# EAGLE design progtypec4-emb-nomux4sercomQFP (EAGLE 9.0.1)

## Sheet 1 of 2
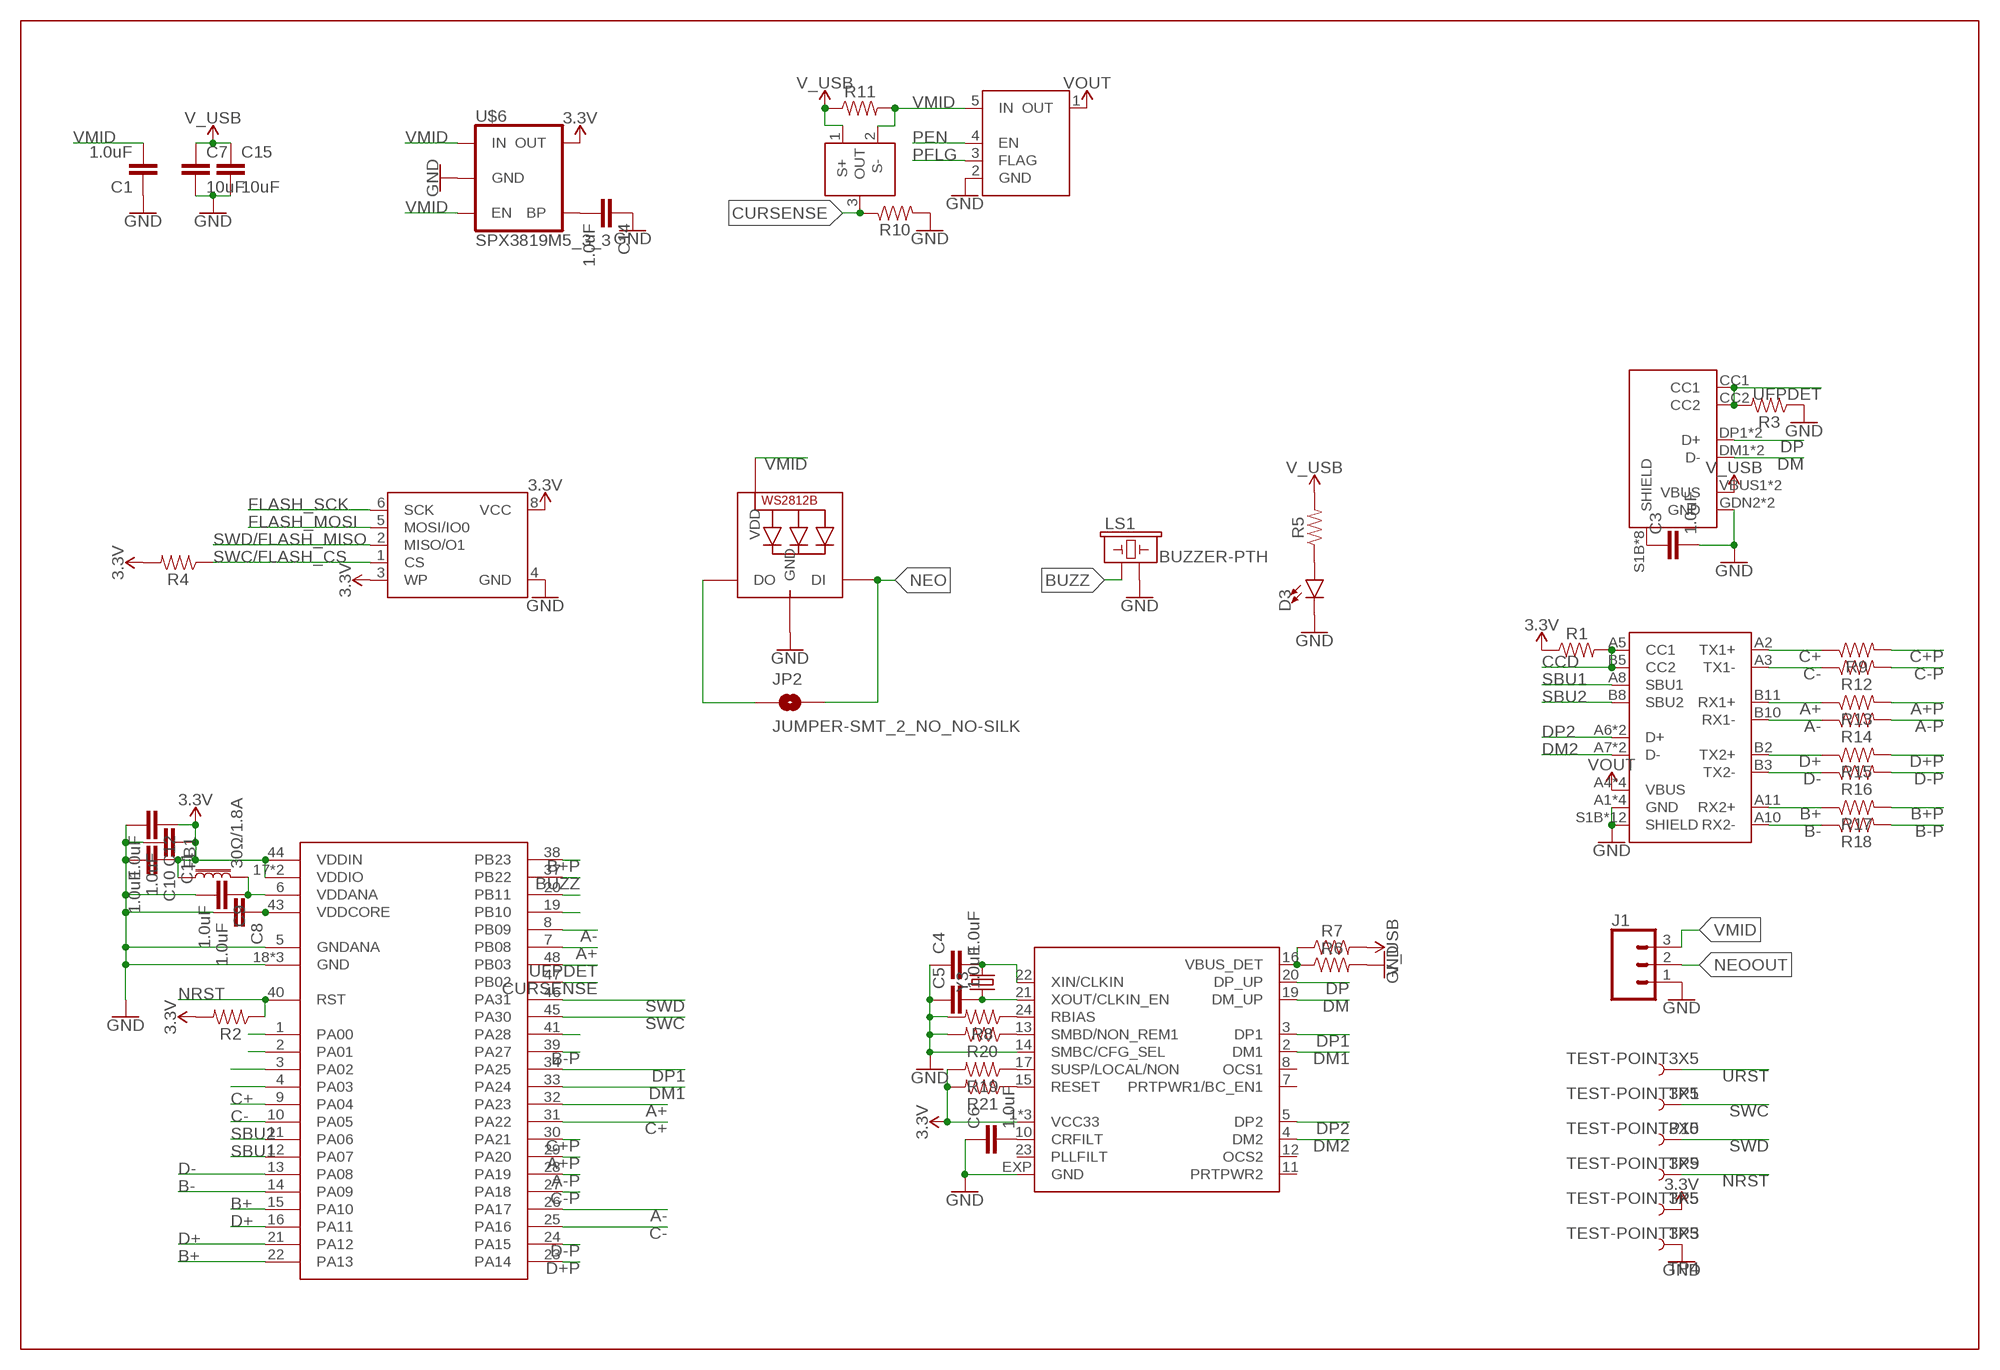
[diagram p0: schematic, sheet 1]

### Parts
C1  1.0uF  1.0UF-0603-16V-10%  [0603]
C3  1.0uF  1.0UF-0603-16V-10%  [0603]
C4  1.0uF  1.0UF-0603-16V-10%  [0603]
C5  1.0uF  1.0UF-0603-16V-10%  [0603]
C6  1.0uF  1.0UF-0603-16V-10%  [0603]
C7  10uF  10UF-0805-10V-10%  [0805]
C8  1.0uF  1.0UF-0603-16V-10%  [0603]
C9  1.0uF  1.0UF-0603-16V-10%  [0603]
C10  1.0uF  1.0UF-0603-16V-10%  [0603]
C11  1.0uF  1.0UF-0603-16V-10%  [0603]
C12  1.0uF  1.0UF-0603-16V-10%  [0603]
C14  1.0uF  1.0UF-0603-16V-10%  [0603]
C15  10uF  10UF-0805-10V-10%  [0805]
D3  LED0603  [LED-0603]
FB1  30Ω/1.8A  FERRITE_BEAD-0603  [0603]
J1  CONN_03SMD_RA_MALE  [1X03_SMD_RA_MALE]
JP2  JUMPER-SMT_2_NO_NO-SILK  [SMT-JUMPER_2_NO_NO-SILK]
LED1  WS2812B3535  [LED3535]
LS1  BUZZER-PTH  [BUZZER-12MM]
R1  RESISTOR0603  [0603]
R2  RESISTOR0603  [0603]
R3  RESISTOR0603  [0603]
R4  RESISTOR0603  [0603]
R5  RESISTOR0603  [0603]
R6  RESISTOR0603  [0603]
R7  RESISTOR0603  [0603]
R8  RESISTOR0603  [0603]
R9  RESISTOR0603  [0603]
R10  RESISTOR0603  [0603]
R11  RESISTOR1206  [1206]
R12  RESISTOR0603  [0603]
R13  RESISTOR0603  [0603]
R14  RESISTOR0603  [0603]
R15  RESISTOR0603  [0603]
R16  RESISTOR0603  [0603]
R17  RESISTOR0603  [0603]
R18  RESISTOR0603  [0603]
R19  RESISTOR0603  [0603]
R20  RESISTOR0603  [0603]
R21  RESISTOR0603  [0603]
TP1  TEST-POINT3X5  [PAD.03X.05]
TP3  TEST-POINT3X5  [PAD.03X.05]
TP4  TEST-POINT3X5  [PAD.03X.05]
TP5  TEST-POINT3X5  [PAD.03X.05]
TP9  TEST-POINT3X5  [PAD.03X.05]
TP10  TEST-POINT3X5  [PAD.03X.05]
U$1  USB-C-HORZ-F  [USB-C_24PIN_HORZ-F-UNTESTED]
U$2  USB-C_USB2ONLY-HORZ-F_12P  [USB-C_12PIN_HORZ-F]
U$3  ZXCT1107  [SOT23-3]
U$4  AP22804/14*W5  [SOT23-5]
U$5  USB2422  [QFN24_4X4_MOREPAD]
U$6  SPX3819M5_3_3  V_REG_SPX3819-SOT23-5  [SOT23-5]
U$7  GD25D10C/05CE  [UDFN8]
U$9  ATSAMD2G1A-A  [TQFP48_7X7]
Y3  CRYSTALSMD-3.2X2.5  [CRYSTAL-SMD-3.2X2.5MM]

### Nets
3.3V: C10.1 C11.1 C12.1 FB1.1 R1.1 R2.2 R4.2 R19.2 R21.2 TP3.P$1 U$5.1(VCC33) U$5.9(VCC33) U$5.18(VCC33) U$6.5(OUT) U$7.3(WP) U$7.8(VCC) U$9.17(VDDIO) U$9.36(VDDIO) U$9.44(VDDIN)
A+: R13.1 U$1.B11(RX1+) U$9.7(PB08) U$9.32(PA23)
A+P: R13.2 U$9.29(PA20)
A-: R14.1 U$1.B10(RX1-) U$9.8(PB09) U$9.26(PA17)
A-P: R14.2 U$9.28(PA19)
B+: R17.1 U$1.A11(RX2+) U$9.15(PA10) U$9.22(PA13)
B+P: R17.2 U$9.38(PB23)
B-: R18.1 U$1.A10(RX2-) U$9.14(PA09)
B-P: R18.2 U$9.39(PA27)
BUZZ: LS1.+ U$9.37(PB22)
C+: R9.1 U$1.A2(TX1+) U$9.9(PA04) U$9.31(PA22)
C+P: R9.2 U$9.30(PA21)
C-: R12.1 U$1.A3(TX1-) U$9.10(PA05) U$9.25(PA16)
C-P: R12.2 U$9.27(PA18)
CCD: R1.2 U$1.A5(CC1) U$1.B5(CC2)
CURSENSE: R10.1 U$3.3(OUT) U$9.47(PB02)
D+: R15.1 U$1.B2(TX2+) U$9.16(PA11) U$9.21(PA12)
D+P: R15.2 U$9.23(PA14)
D-: R16.1 U$1.B3(TX2-) U$9.13(PA08)
D-P: R16.2 U$9.24(PA15)
DM: U$2.DM1(D-) U$2.DM2(D-) U$5.19(DM_UP)
DM1: U$5.2(DM1) U$9.33(PA24)
DM2: U$1.A7(D-) U$1.B7(D-) U$5.4(DM2)
DP: U$2.DP1(D+) U$2.DP2(D+) U$5.20(DP_UP)
DP1: U$5.3(DP1) U$9.34(PA25)
DP2: U$1.A6(D+) U$1.B6(D+) U$5.5(DP2)
FLASH_MOSI: U$7.5(MOSI/IO0)
FLASH_SCK: U$7.6(SCK)
GND: C1.1 C3.2 C4.1 C5.1 C6.1 C7.2 C8.2 C9.2 C10.2 C11.2 C12.2 C14.1 C15.2 D3.C J1.1 LED1.4(GND) LS1.- R3.1 R6.2 R8.2 R10.2 R20.2 TP4.P$1 U$1.A1(GND) U$1.A12(GND) U$1.B1(GND) U$1.B12(GND) U$1.S1B(SHIELD) U$1.S1T(SHIELD) U$1.S2B(SHIELD) U$1.S2T(SHIELD) U$1.S3B(SHIELD) U$1.S3T(SHIELD) U$1.S4B(SHIELD) U$1.S4T(SHIELD) U$1.S5B(SHIELD) U$1.S5T(SHIELD) U$1.S6B(SHIELD) U$1.S6T(SHIELD) U$2.GDN2(GND) U$2.GND1(GND) U$4.2(GND) U$5.14(SMBC/CFG_SEL) U$5.EXP(GND) U$6.2(GND) U$7.4(GND) U$9.5(GNDANA) U$9.18(GND) U$9.35(GND) U$9.42(GND)
N$1: D3.A R5.1
N$3: R6.1 R7.1 U$5.16(VBUS_DET)
N$6: R8.1 U$5.24(RBIAS)
N$7: C4.2 U$5.22(XIN/CLKIN) Y3.3
N$8: C5.2 U$5.21(XOUT/CLKIN_EN) Y3.1
N$10: R19.1 U$5.17(SUSP/LOCAL/NON)
N$11: C6.2 U$5.10(CRFILT)
N$12: R20.1 U$5.13(SMBD/NON_REM1)
N$15: U$9.2(PA01)
N$16: C3.1 U$2.S1B(SHIELD) U$2.S1T(SHIELD) U$2.S2B(SHIELD) U$2.S2T(SHIELD) U$2.S3B(SHIELD) U$2.S3T(SHIELD) U$2.S4B(SHIELD) U$2.S4T(SHIELD)
N$17: U$9.3(PA02)
N$18: U$9.4(PA03)
N$23: U$9.1(PA00)
N$26: U$9.20(PB11)
N$27: C14.2 U$6.4(BP)
N$28: U$9.19(PB10)
N$29: U$9.41(PA28)
NEO: JP2.2 LED1.1(DI)
NEOOUT: J1.2 JP2.1 LED1.3(DO)
NRST: R2.1 TP5.P$1 U$9.40(RST)
PEN: U$4.4(EN)
PFLG: U$4.3(FLAG)
SBU1: U$1.A8(SBU1) U$9.12(PA07)
SBU2: U$1.B8(SBU2) U$9.11(PA06)
SWC: TP10.P$1 U$9.45(PA30)
SWC/FLASH_CS: R4.1 U$7.1(CS)
SWD: TP9.P$1 U$9.46(PA31)
SWD/FLASH_MISO: U$7.2(MISO/O1)
UFPDET: R3.2 U$2.CC1 U$2.CC2 U$9.48(PB03)
URST: R21.1 TP1.P$1 U$5.15(RESET)
V_USB: C7.1 C15.1 R5.2 R7.2 R11.1 U$2.VBUS1(VBUS) U$2.VBUS2(VBUS) U$3.1(S+)
VCCA: C9.1 FB1.2 U$9.6(VDDANA)
VCORE: C8.1 U$9.43(VDDCORE)
VMID: C1.2 J1.3 LED1.2(VDD) R11.2 U$3.2(S-) U$4.5(IN) U$6.1(IN) U$6.3(EN)
VOUT: U$1.A4(VBUS) U$1.A9(VBUS) U$1.B4(VBUS) U$1.B9(VBUS) U$4.1(OUT)
Unconnected: U$5.7(PRTPWR1/BC_EN1) U$5.8(OCS1) U$5.11(PRTPWR2) U$5.12(OCS2) U$5.23(PLLFILT)

## Sheet 2 of 2

## Library data of the parts
C1 C3-C6 C8-C12 C14 = SparkFun-Capacitors:1.0UF: 1µF ceramic capacitors A capacitor is a passive two-terminal electrical component used to store electrical energy temporarily in an electric field.; PROD_ID: CAP-00868
C7 C15 = SparkFun-Capacitors:10UF: 10.0µF ceramic capacitors A capacitor is a passive two-terminal electrical component used to store electrical energy temporarily in an electric field.; PROD_ID: CAP-11330
D3 = SparkFun-LED:LED: LED (Generic) Standard schematic elements and footprints for 5mm, 3mm, 1206, and 0603 sized LEDs. Generic LEDs with no color specified.
FB1 = SparkFun-Coils:FERRITE_BEAD: Ferrite Bead (blocks, cores, rings, chokes, etc.) Inductor with layers of ferrite used to suppress high frequencies. Often used to isolate high frequency noise. SparkFun Products: IOIO-OTG - V2.2 <https://www.sparkfun.com/products/13613> SparkFun SAMD21 Mini Breakout <https://www.sparkfun.com/products/13664> SparkFun 6 Degrees of Freedom Breakout - LSM6DS3 <https://www.sparkfun.com/products/13339> SparkFun SAMD21 Dev Breakout <https://www.sparkfun.com/products/13672>; PROD_ID: NDUC-07859
J1 = SparkFun-Connectors:CONN_03: Multi connection point. Often used as Generic Header-pin footprint for 0.1 inch spaced/style header connections On any of the 0.1 inch spaced packages, you can populate with these: Break Away Headers - Straight <https://www.sparkfun.com/products/116> (PRT-00116) Break Away Male Headers - Right Angle <https://www.sparkfun.com/products/553> (PRT-00553) Female Headers <https://www.sparkfun.com/products/115> (PRT-00115) Break Away Headers - Machine Pin <https://www.sparkfun.com/products/117> (PRT-00117) Break Away Female Headers - Swiss Machine Pin <https://www.sparkfun.com/products/743> (PRT-00743) Stackable Header - 3 Pin (Female, 0.1") <https://www.sparkfun.com/products/13875> (PRT-13875) For SCREWTERMINALS and SPRING TERMINALS visit here: Screw Terimnals on SparkFun.com <https://www.sparkfun.com/search/results?term=Screw+Terminals> (5mm/3.5mm/2.54mm spacing) This device is also useful as a general connection point to wire up your design to another part of your project. Our various solder wires solder well into these plated through hole pads. Hook-Up Wire - Assortment (Stranded, 22 AWG) <https://www.sparkfun.com/products/11375> (PRT-11375) Hook-Up Wire - Assortment (Solid Core, 22 AWG) <https://www.sparkfun.com/products/11367> (PRT-11367) View the entire wire category on our website here <https://www.sparkfun.com/categories/141> Special notes: Molex polarized connector foot print use with SKU : PRT-08232 with associated crimp pins and housings.; PROD_ID: CONN-10925
JP2 = SparkFun-Jumpers:JUMPER-SMT_2_NO: Normally open jumper This jumper has two pads in close proximity to each other. Apply solder to close the connection. Round pads are easier to solder for beginners, but are a lot larger. SparkFun Product that uses the round pads: SparkFun EL Sequencer <https://www.sparkfun.com/products/12781>
LED1 = 12voltman:WS2812B
LS1 = SparkFun-Electromechanical:BUZZER: Buzzer Small round buzzers that operate around the audible 2kHz range. You can use these as speakers to create simple music or user interfaces. Variant Overview: PTH - Mini Speaker - PC Mount 12mm 2.048kHz <https://www.sparkfun.com/products/7950> PTH_KIT - Mini Speaker - PC Mount 12mm 2.048kHz <https://www.sparkfun.com/products/7950> KIT simplifies soldering by adding stop mask to one side of the pads. PTH_NO_SILK - Mini Speaker - PC Mount 12mm 2.048kHz <https://www.sparkfun.com/products/7950> No silkscreen indicator of buzzer outline. PTH_KIT_NO_SILK - Mini Speaker - PC Mount 12mm 2.048kHz <https://www.sparkfun.com/products/7950> KIT package w/o silkscreen SMD - Buzzer Audio Magnetic (CCV-084B16) SMD buzzer used on, e.g. the LilyPad Buzzer <https://www.sparkfun.com/products/8463> and RFID USB Reader <https://www.sparkfun.com/products/9963>. SMD_KIT - Buzzer Audio Magnetic (CCV-084B16) SMD Buzzer with elongated pins to make soldering easier. Used on the SparkFun Simon Says - Surface Mount Soldering Kit <https://www.sparkfun.com/products/10935>.; PROD_ID: COMP-08253; SF_SKU: COM-07950
R1-R21 = SparkFun-Resistors:RESISTOR: Generic Resistor Package
TP1 TP3-TP5 TP9 TP10 = SparkFun-Connectors:TEST-POINT: SparkFun Test Points Bare copper test points for troubleshooting or In-Circuit-Testing. These are used by our Production team for verifying production board runs using pogo-pins on test beds. SparkFun Products: SparkFun LSM9DS1 Breakout <https://www.sparkfun.com/products/13284> SparkFun PSOC <https://www.sparkfun.com/products/13714> SparkFun Load Cell Amplifier <https://www.sparkfun.com/products/13879>
U$1 = 12voltman:USB-C
U$2 = 12voltman:USB-C_USB2ONLY
U$3 = 12voltman:ZXCT110
U$4 = 12voltman:AP22804/14
U$5 = 12voltman:USB2422
U$6 = SparkFun-IC-Power:V_REG_SPX3819: SPX3819 Voltage Regulator 3.3V 500mA, 16V input Datasheet <https://www.exar.com/content/document.ashx?id=22106> SparkFun Products: SparkFun Serial Controlled Motor Driver <https://www.sparkfun.com/products/13911>; PROD_ID: VREG-13321
U$7 = 12voltman:GD25D10C/05C
U$9 = 12voltman:ATSAMD2*G1*: ATSAMD2*G - 32bit low-power Cortex M0+ microcontroller This part is for the middle pin count pieces in the SAMD20 and SAMD21 series of low-power microcontrollers. The SAMD21 series adds USB and DMA to the SAMD20 series. Includes Atmel's configurable serial interfaces (SERCOMs) which can be configured to be a UART, I2C, LIN, or SPI. Available packages include TQFP and QFN. (For WLCSP package see separate part) Technical specifications: VCC: 1.62-3.63V Core frequency up to 48MHz Program flash: 32/64/128/256 kb RAM: 4/8/16/32 kb SERCOMS: 6 GPIOs: 38 ADC channels: 14 ADC resolution: 12 bits DACs: 1
Y3 = SparkFun-Clocks:CRYSTAL: Crystals (Generic) These are passive quartz crystals, which can be used as a clock source for a microcontroller. Crystal's are two-terminal devices. They require external "load" capacitors to generate an oscillating signal.

## Board
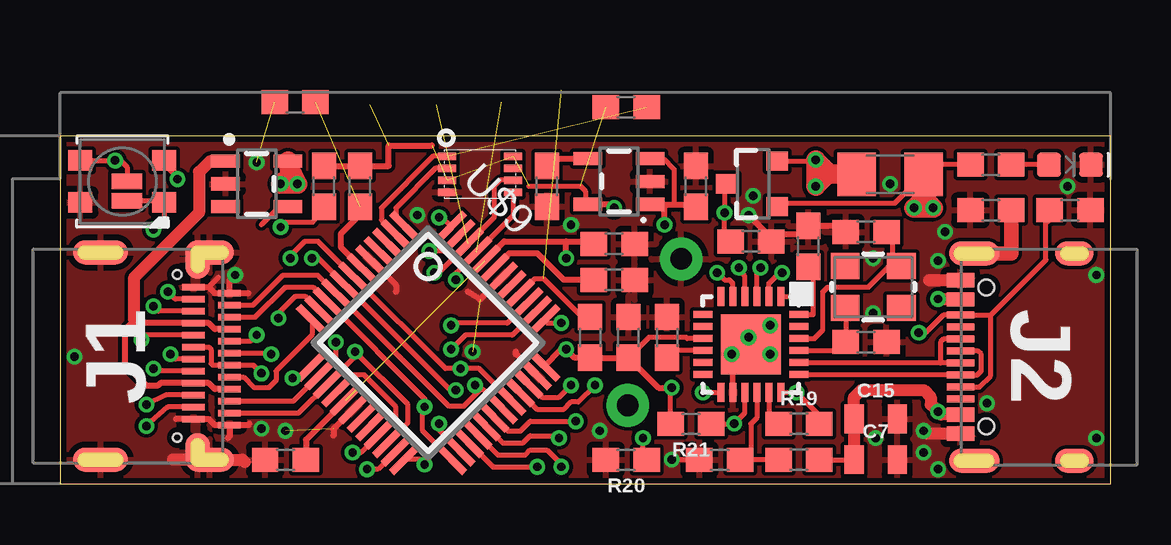
[diagram p1: board, top side]
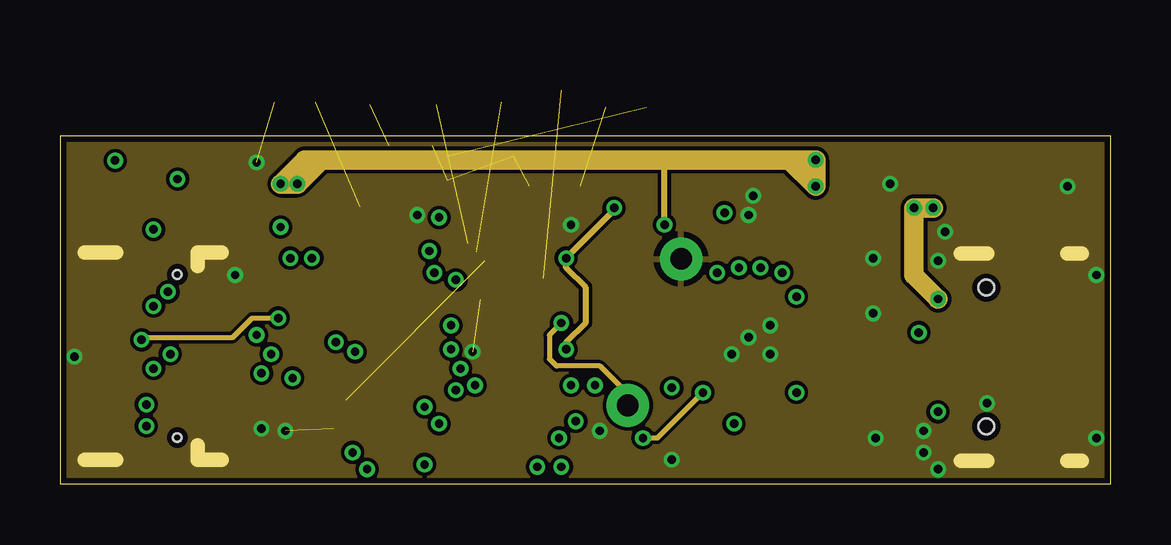
[diagram p2: board, inner layer Route2]
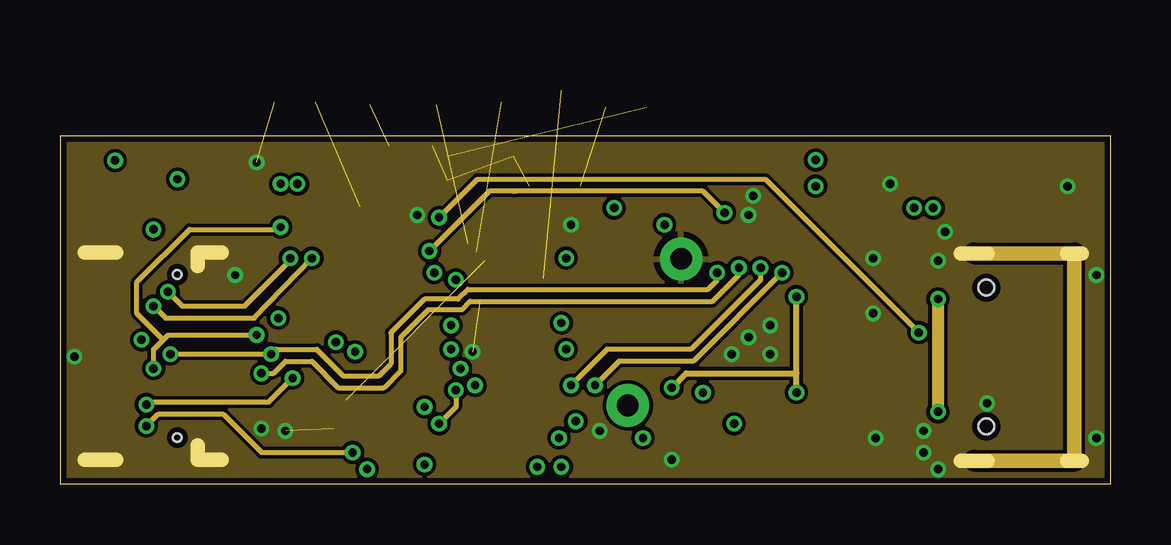
[diagram p3: board, inner layer Route15]
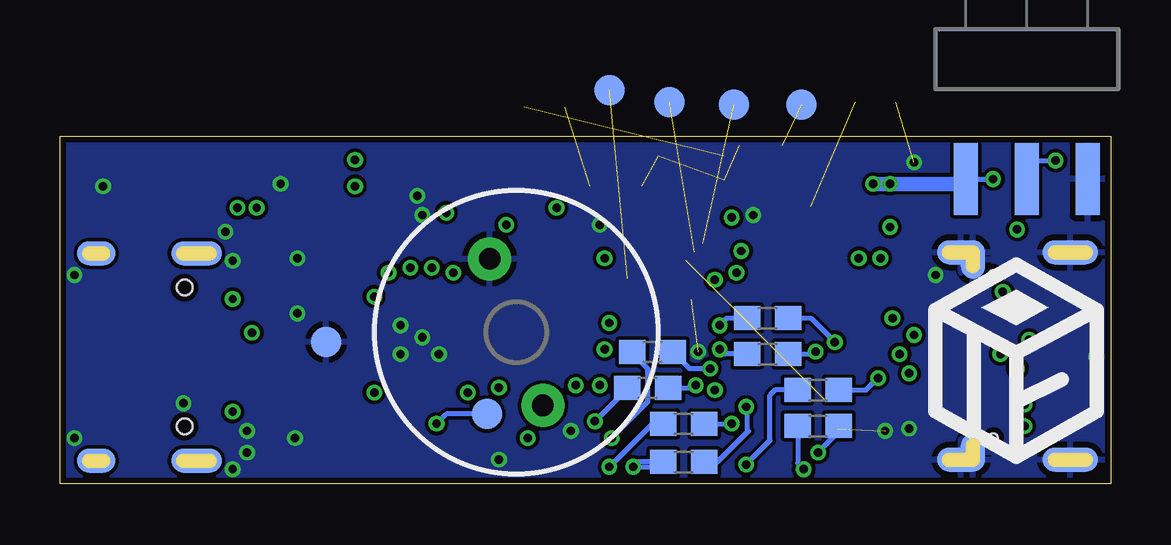
[diagram p4: board, bottom side, seen from below]

Size 43.8 x 14.5 mm. Coordinates in mm from the lower left corner, seen from the top.
Outline: 0,0 43.8,0 43.8,14.5 0,14.5 0,0
Copper layers (1*2*15*16): Top 0.035mm / dielectric 0.2mm / Route2 0.0175mm / dielectric 1.1mm / Route15 0.0175mm / dielectric 0.2mm / Bottom 0.035mm
Design rules "SeeedStudio_4layer_DRU": minimum track width 6mil, minimum drill 12mil, track to track 6mil, track to pad 6mil, pad to pad 6mil, via to via 6mil, smd to smd 0mil, copper to edge 10mil, drill to drill 10mil, minimum pad ring 6mil, minimum via ring 6mil, stop-mask expansion 2mil, vias tented up to drill 25mil, thermal gap 10mil

### Footprints (pad centres in the part's own frame; a part is rotated, then mirrored left to right if it is on the bottom)
0603 = smd 1.1 x 1: 1 -0.85,0; 2 0.85,0
0805 = smd 0.8 x 1.2: 1 -0.9,0; 2 0.9,0
LED-0603 = smd 1 x 1: A -0.877,0; C 0.877,0
1X03_SMD_RA_MALE = smd 1 x 3: 1 -2.54,5; 2 0,5; 3 2.54,5
SMT-JUMPER_2_NO_NO-SILK = smd 0.635 x 1.27: 1 -0.406,0; 2 0.406,0
LED3535 = smd 1 x 0.85: 1 -1.75,0.875; 2 -1.75,-0.875; 3 1.75,-0.875; 4 1.75,0.875
BUZZER-12MM = drill 0.9 pad 1.778: + 3.25,0; - -3.25,0
1206 = smd 1.6 x 1.8: 1 -1.4,0; 2 1.4,0
PAD.03X.05 = smd 1.27 x 1.27: P$1 0,0
USB-C_24PIN_HORZ-F-UNTESTED = smd 0.28 x 0.95: A1 2.625,-1.975; A2 2.125,-1.975; A3 1.625,-1.975; A4 1.125,-1.975; A5 0.625,-1.975; A6 0.125,-1.975; A7 -0.375,-1.975; A8 -0.875,-1.975; A9 -1.375,-1.975; A10 -1.875,-1.975; A11 -2.375,-1.975; A12 -2.875,-1.975; B1 -2.625,-0.475; B2 -2.125,-0.475; B3 -1.625,-0.475; B4 -1.125,-0.475; B5 -0.625,-0.475; B6 -0.125,-0.475; B7 0.375,-0.475; B8 0.875,-0.475; B9 1.375,-0.475; B10 1.875,-0.475; B11 2.375,-0.475; B12 2.875,-0.475 | smd 1 x 2.3 bottom: S1B -4.32,3.4; S6B 4.32,3.4 | smd 1 x 2.3: S1T -4.32,3.4; S6T 4.32,3.4 | smd 1.6 x 1 bottom: S2B -4.02,-0.65; S5B 4.02,-0.65 | smd 1.6 x 1: S2T -4.02,-0.65; S5T 4.02,-0.65 | smd 1 x 2 bottom: S3B -4.32,-1.15; S4B 4.32,-1.15 | smd 1 x 2: S3T -4.32,-1.15; S4T 4.32,-1.15 | hole 0.35: -3.4,0.2; 3.4,0.2
USB-C_12PIN_HORZ-F = smd 0.3 x 1.15: CC1 1.25,-0.575; CC2 -1.75,-0.575; DM1 -0.25,-0.575; DM2 0.75,-0.575; DP1 0.25,-0.575; DP2 -0.75,-0.575; SBU1 -1.25,-0.575; SBU2 1.75,-0.575 | smd 0.6 x 1.15: GDN2 3.2,-0.575; GND1 -3.2,-0.575; VBUS1 -2.4,-0.575; VBUS2 2.4,-0.575 | smd 1 x 2.1 bottom: S1B -4.32,0; S4B 4.32,0 | smd 1 x 2.1: S1T -4.32,0; S4T 4.32,0 | smd 1 x 1.6 bottom: S2B -4.32,4.18; S3B 4.32,4.18 | smd 1 x 1.6: S2T -4.32,4.18; S3T 4.32,4.18 | hole 0.65: -2.89,0.5; 2.89,0.5
SOT23-3 = smd 0.8 x 0.9: 1 -0.95,-1; 2 0.95,-1; 3 0,1.1
SOT23-5 = smd 0.55 x 1.2: 1 -0.95,-1.3; 2 0,-1.3; 3 0.95,-1.3; 4 0.95,1.3; 5 -0.95,1.3
QFN24_4X4_MOREPAD = smd 0.8 x 0.3: 1 -2,1.25; 2 -2,0.75; 3 -2,0.25; 4 -2,-0.25; 5 -2,-0.75; 6 -2,-1.25; 13 2,-1.25; 14 2,-0.75; 15 2,-0.25; 16 2,0.25; 17 2,0.75; 18 2,1.25 | smd 0.3 x 0.8: 7 -1.25,-2; 8 -0.75,-2; 9 -0.25,-2; 10 0.25,-2; 11 0.75,-2; 12 1.25,-2; 19 1.25,2; 20 0.75,2; 21 0.25,2; 22 -0.25,2; 23 -0.75,2; 24 -1.25,2 | smd 2.5 x 2.5: EXP 0,0
UDFN8 = smd 0.3 x 0.75: 1 -0.75,-1.375; 2 -0.25,-1.375; 3 0.25,-1.375; 4 0.75,-1.375; 5 0.75,1.375; 6 0.25,1.375; 7 -0.25,1.375; 8 -0.75,1.375
TQFP48_7X7 = smd 0.3 x 1.6: 1 -2.75,-4.1; 2 -2.25,-4.1; 3 -1.75,-4.1; 4 -1.25,-4.1; 5 -0.75,-4.1; 6 -0.25,-4.1; 7 0.25,-4.1; 8 0.75,-4.1; 9 1.25,-4.1; 10 1.75,-4.1; 11 2.25,-4.1; 12 2.75,-4.1; 25 2.75,4.1; 26 2.25,4.1; 27 1.75,4.1; 28 1.25,4.1; 29 0.75,4.1; 30 0.25,4.1; 31 -0.25,4.1; 32 -0.75,4.1; 33 -1.25,4.1; 34 -1.75,4.1; 35 -2.25,4.1; 36 -2.75,4.1 | smd 1.6 x 0.3: 13 4.1,-2.75; 14 4.1,-2.25; 15 4.1,-1.75; 16 4.1,-1.25; 17 4.1,-0.75; 18 4.1,-0.25; 19 4.1,0.25; 20 4.1,0.75; 21 4.1,1.25; 22 4.1,1.75; 23 4.1,2.25; 24 4.1,2.75; 37 -4.1,2.75; 38 -4.1,2.25; 39 -4.1,1.75; 40 -4.1,1.25; 41 -4.1,0.75; 42 -4.1,0.25; 43 -4.1,-0.25; 44 -4.1,-0.75; 45 -4.1,-1.25; 46 -4.1,-1.75; 47 -4.1,-2.25; 48 -4.1,-2.75
CRYSTAL-SMD-3.2X2.5MM = smd 1.2 x 1.1: 1 -1.175,-0.875; 2 1.175,-0.875; 3 1.175,0.875; 4 -1.175,0.875

### Placement (x,y rotation side)
C1  26.5,12.4 270 top
C3  38.8,11.4 180 top
C4  33.6,10.5 0 top
C5  33.6,5.9 180 top
C6  25.3,6.1 270 top
C7  34,1 0 top
C8  23.1,8.5 0 top
C9  9.8,15.9 180 top
C10  23.7,6.1 90 top
C11  23.1,10 0 top
C12  9.4,1 180 top
C14  20.3,12.4 90 top
C15  34,2.7 0 top
D3  42.1,13.3 0 top
FB1  12.5,12.4 270 top
J1  3.5,17.7 180 bottom
JP2  2.8,12.2 270 top
LED1  2.6,12.6 180 top
LS1  24.78,6.32 290 bottom
R1  11,12.4 270 top
R2  22.1,6.1 270 top
R3  42.1,11.4 180 top
R4  23.6,15.7 180 top
R5  38.8,13.3 180 top
R6  27.5,1 180 top
R7  30.8,1 0 top
R8  31.2,9.9 90 top
R9  19.3,4 180 bottom
R10  28.8,10.1 0 top
R11  34.6,12.9 180 top
R12  17.8,0.9 180 bottom
R13  19.1,5.5 180 bottom
R14  17.8,2.5 180 bottom
R15  12.2,2.4 180 bottom
R16  12.2,3.9 180 bottom
R17  14.3,5.4 180 bottom
R18  14.3,6.9 180 bottom
R19  30.8,2.5 0 top
R20  23.6,1 180 top
R21  26.3,2.5 180 top
TP1  26,2.9 0 bottom
TP3  12.9,15.8 270 bottom
TP4  32.7,5.9 270 bottom
TP5  20.9,16.4 270 bottom
TP9  15.7,15.8 270 bottom
TP10  18.4,15.9 270 bottom
U$1  5.09,5.32 90 top
U$2  38.11,5.28 270 top
U$3  28.9,12.5 90 top
U$4  8.2,12.5 270 top
U$5  28.8,5.8 270 top
U$6  23.3,12.6 90 top
U$7  17.5,12.9 270 top
U$9  ATSAMD2G1*A-A  [TQFP48_7X7]  15.35,5.87 225 top
Y3  33.9,8.2 0 top

### Tracks (layer width: path | path; a pad name or v marks a point on that pad's centre or on a via)
3.3V  (via drill 0.35)  (6 unrouted)
  Top 0.203: U$5.18 v30.7,3.8 31.65,2.85 R19.2 | U$5.1 v30.7,7.8 | U$6.5 21.9,11.75 21.9,12.2 21.7,12.4 19.55,12.4 | U$6.5 | C10.1 24.55,6.1 26.1,6.1 26.15,6.05 U$5.9 | R21.2 25.45,3.95 v25.5,4
  Top 0.254: 15.5,14.1 13.7,14.1 13.7,13.25 FB1.1 R1.1 | 23.9,5 C10.1 | R2.2 22.35,5 | R2.2 C10.1 | C10.1 24.95,4 v25.5,4 | U$6.5 22.95,11.65 v23.1,11.5 | U$9.17 10.25,1.83 C12.1 | U$9.44 18.52,10.1 21.1,10.1 | C11.1 22.15,10.1 21.1,10.1 | U$9.36 20.87,5.6 v21.1,5.6 21.45,5.25 R2.2 | v21.1,9.4 21.1,10.1
  Route2 0.254: v23.1,11.5 23.1,11.4 v21.1,9.4 21.1,9 21.9,8.2 21.9,6.7 21.1,5.9 v21.1,5.6
  Route15 0.254: v30.7,3.8 30.7,4.6 | 30.7,4.6 v30.7,7.8 | v25.5,4 26.1,4.6 30.7,4.6
A+  (via drill 0.35)
  Top 0.203: U$1.B11 4.8,7.7 v4.5,8 | U$9.32 17.48,4.8 v16.7,4.8 16.06,4.8 U$9.7 10.76,10.1 10.2,10.1 9.6,9.5 v9.6,9.4
  Route15 0.203: v4.5,8 5.1,7.4 7.7,7.4 9.6,9.3 v9.6,9.4
  Bottom 0.203: R13.1 17.55,4.8 v16.7,4.8
A+P  (via drill 0.35)
  Top 0.203: U$9.29 18.46,1.7 19.3,1.7 19.6,2 20.7,2 v20.8,1.9
  Bottom 0.203: v20.8,1.9 19.3,3.4 19.3,4.8 19.95,5.45 R13.2
A-  (via drill 0.35)
  Top 0.203: U$1.B10 4.11,7.2 v3.9,7.4 | v16.5,3.9 16.26,3.9 U$9.8 10.76,9.4 v10.5,9.4 | U$9.26 15.8,2.23 v15.8,2.5
  Route15 0.203: v3.9,7.4 4.4,6.9 8.1,6.9 v10.5,9.4 | v16.5,3.9 16.5,3.2 v15.8,2.5
  Bottom 0.203: R14.1 v15.8,2.5
A-P  (via drill 0.35)
  Top 0.203: U$9.28 18.25,1.2 19.4,1.2 19.6,1.4 20.3,1.4 20.9,0.8 v20.9,0.7
  Bottom 0.203: R14.2 19.1,2.5 v20.9,0.7
B+  (via drill 0.35)
  Top 0.203: U$9.22 14.5,2.55 14.5,3.3 v12.3,5.5 12.3,5.3 U$9.15 9.95,2.94 U$1.A11
  Bottom 0.203: R17.1 12.4,5.4 v12.3,5.5
B+P  (via drill 0.35)
  Top 0.203: U$9.38 18.86,6.2 16.9,6.2 v16.3,5.6
  Bottom 0.203: R17.2 16.1,5.4 v16.3,5.6
B-  (via drill 0.35)
  Top 0.203: U$1.A10 9.74,3.44 U$9.14 11.5,5.21 v11.5,5.9
  Bottom 0.203: R18.1 12.5,6.9 v11.5,5.9
B-P  (via drill 0.35)
  Top 0.203: U$9.39 18.65,6.7 16.4,6.7 v16.3,6.6
  Bottom 0.203: v16.3,6.6 16,6.9 R18.2
BUZZ  (via drill 0.35)
  Top 0.203: U$9.37 20.32,6.7 v20.9,6.7
  Route2 0.203: v20.9,6.7 20.4,6.2 20.4,5.2 20.7,4.9 22.5,4.9 23.67,3.73 LS1.+
C+  (via drill 0.35)
  Top 0.203: U$1.A2 8.04,7.45 9.3,8.7 10.75,8.7 U$9.9 16.23,3.23 16.82,3.23 17.3,3.7 | U$9.31 17.67,3.9 17.5,3.9 17.3,3.7 | 17.3,3.7 v17.3,4.1
  Bottom 0.203: R9.1 17.4,4 v17.3,4.1
C+P  (via drill 0.35)
  Top 0.203: U$9.30 18.66,2.2 19.2,2.2 19.6,2.6 v21.5,2.6
  Bottom 0.203: R9.2 20.15,3.95 v21.5,2.6
C-  (via drill 0.35)
  Top 0.203: U$1.A3 8.14,6.95 9.4,8.2 10.54,8.2 U$9.10 15.2,3.54 v15.2,3.2 15.1,3.1 15.1,2.23 U$9.25
  Bottom 0.203: R12.1 16.4,0.9 15.15,2.15 | 15.15,2.15 15.1,2.2 | 15.15,2.15 15.15,3.15 v15.2,3.2
C-P  (via drill 0.35)
  Top 0.203: U$9.27 18.04,0.7 v19.9,0.7
  Bottom 0.203: 18.7,0.9 18.9,0.7 v19.9,0.7 19.7,0.9 R12.2
CCD  (via drill 0.35)
  Top 0.203: U$1.A5 7.95,5.95 v8.2,6.2 | U$1.B5 4,4.7 v3.9,4.8 | v9.2,10.7 9.4,10.9 10.55,10.9 R1.2
  Route15 0.203: v3.9,4.8 3.9,5.6 4.3,6 | 4.3,6 4.5,6.2 v8.2,6.2 | 4.3,6 3.2,7.1 3.2,8.4 5.4,10.6 9.1,10.6 v9.2,10.7
CURSENSE  (via drill 0.35)
  Top 0.203: R10.1 27.7,10.35 v27.7,11.3 27.7,12.5 U$3.3 | U$9.47 15.99,9.7 v15.4,9.7
  Route15 0.203: v27.7,11.3 26.8,12.2 19,12.2 18.9,12.2 17.9,12.2 v15.4,9.7
D+  (via drill 0.35)
  Top 0.203: U$1.B2 4.5,3.19 v3.6,2.4 | v12.2,1.3 12.54,1.3 U$9.21 14,2.76 14,3.2 12.65,4.55 12.26,4.55 U$9.16
  Route15 0.203: v3.6,2.4 4.1,2.9 6.8,2.9 8.4,1.3 v12.2,1.3
  Bottom 0.203: R15.1 11.35,2.15 v12.2,1.3
D+P  (via drill 0.35)
  Top 0.203: U$9.23 13.26,0.6 v12.8,0.6
  Bottom 0.203: R15.2 13.05,0.85 v12.8,0.6
D-  (via drill 0.35)
  Top 0.203: U$1.B3 4.41,3.69 v3.6,3.3 | U$9.13 9.99,4.4 v9.7,4.4
  Route15 0.203: v3.6,3.3 3.7,3.4 8.7,3.4 v9.7,4.4
  Bottom 0.203: R16.1 10.2,3.9 v9.7,4.4
D-P  (via drill 0.35)
  Top 0.203: U$9.24 14.97,1.03 v15.2,0.8
  Bottom 0.203: v15.2,0.8 14.2,1.8 14.2,3.7 14,3.9 R16.2
DM
  Top 0.203: U$2.DM1 38.27,5.53 38.4,5.4 38.4,4.7 38.23,4.53 U$2.DM2 30.82,4.53 U$5.19
DM1  (via drill 0.35)
  Top 0.203: U$5.2 29.55,8.35 30,8.8 v30.1,8.8 | v22.3,4.1 21.6,3.4 21.3,3.4 21,3.1 19.89,3.1 U$9.33
  Route15 0.203: 30.05,8.7 30.05,8.75 v30.1,8.8 26.4,5.1 23.3,5.1 v22.3,4.1
DM2  (via drill 0.35)
  Top 0.203: U$1.B7 6.21,5.7 6.3,5.6 6.3,5 6.36,4.95 U$1.A7 8.05,4.95 v8.4,4.6 | U$5.4 28.55,8.65 28.3,8.9 v28.3,9
  Route15 0.203: v28.3,9 28.3,8.7 27.2,7.6 17.1,7.6 16.75,7.25 15.35,7.25 14.2,6.1 14.2,4.7 13.5,4 11.6,4 10.5,5.1 9.4,5.1 8.9,4.6 v8.4,4.6
DP
  Top 0.203: U$2.DP2 36.83,6.03 36.7,5.9 36.7,5.03 | U$2.DP1 36.7,5.03 | 36.7,5.03 30.82,5.03 U$5.20
DP1  (via drill 0.35)
  Top 0.203: U$5.3 29.05,8.85 v29.2,9 | v21.3,4.1 20.8,3.6 20.09,3.6 U$9.34
  Route15 0.203: v21.3,4.1 22.8,5.6 26.3,5.6 29.2,8.5 v29.2,9
DP2  (via drill 0.35)
  Top 0.203: U$1.B6 4.8,5.2 v4.6,5.4 | U$5.5 28.05,8.35 27.9,8.5 27.7,8.5 v27.4,8.8 | U$1.A6 8.76,5.45 v8.8,5.4
  Route15 0.203: v4.6,5.4 v8.8,5.4 9,5.6 10.7,5.6 11.8,4.5 13.3,4.5 13.8,5 13.8,6.3 15.2,7.7 16.6,7.7 17,8.1 27,8.1 27.4,8.5 v27.4,8.8
FLASH_MOSI
  Top 0.203: U$7.5 18.88,11.18 17.7,10
FLASH_SCK
  Top 0.203: U$7.6 18.35,12.65 18.1,12.4 18.1,11.1 17.3,10.3
GND  (via drill 0.35)  (3 unrouted)
  Top 0.203: U$1.B12 6.2,8.2 6.6,8.6 | U$5.EXP v28,5.4 28.05,5.05 U$5.14 | R6.2 v25.5,1
  Top 0.254: U$1.B12 6.21,8.2 6.46,7.95 U$1.A1 | U$1.A12 6.46,2.44 6.21,2.69 U$1.B1 4.83,2.69 | U$1.A12 7.84,2.44 7.9,2.5 | U$1.A12 7.07,1.97 7,1.9 | U$1.A1 7.07,8.46 7.1,8.5 | U$1.A1 7.84,7.95 | C4.1 32.5,10.75 R8.2 30.85,10.4 29.95,10.4 R10.2 29.65,10.25 28.9,11 | U$9.18 11.4,2.28 11.4,2 | U$9.5 14,8.28 14,8 | U$9.42 17.5,7.67 17,8 | U$9.35 19,5.4 19,5.5
  Top 0.508: U$2.GND1 36.22,8.48 | U$1.S3B 7.6,1 7.7,0.9 | U$1.S2T 5.44,1 4.7,1 | U$2.GDN2 36.12,2.08 v36,2.2
  other vias: 36.6,0.6 36,1.3 38.65,3.35 0.6,5.3 43.2,1.9 29.6,5.4 36.6,9.3 36.9,10.5 7.3,8.7 29.6,6.6 43.2,8.7 42,12.4 34.6,12.5 8.2,13.4 28.7,6.1 28.7,11.2 28.9,12 22.5,2.2 34,1.9 8.4,2.3 9.4,2.2 21.3,10.8 33.9,7.1 33.9,9.4 17.2,5.5 14.9,11.2
  pour Top: 0,15.3 44.3,15.3 44.3,0 0,0
  pour Bottom: 44.3,15.3 0,15.3 0,0 44.3,0
  pour Route2: 44.3,15.3 0,15.3 0,0 44.3,0
  pour Route15: 44.3,15.3 0,15.3 0,0 44.3,0
N$1
  Top 0.203: D3.A R5.1
N$3
  Top 0.203: R7.1 R6.1 28.8,1.45 28.8,2.5 29.05,2.75 U$5.16
N$6
  Top 0.203: U$5.24 31.4,7.05 31.4,8.85 R8.1
N$7
  Top 0.203: U$5.22 31.45,6.05 31.8,6.4 31.8,8 32,8.2 33.7,8.2 34.58,9.07 34.7,9.07 | 34.7,9.07 Y3.3 | C4.2 34.7,10.15 34.7,9.07
N$8
  Top 0.203: U$5.21 32.3,5.55 C5.2 32.75,7.3 Y3.1
N$9
  cutout Top: 27.8,6.3 27,6.3 27,5.4 27.8,5.4
  cutout Top: 30.6,6.3 29.8,6.3 29.8,5.4 30.6,5.4
  cutout Top: 28.4,7.7 28.4,6.9 29.3,6.9 29.3,7.7
  cutout Top: 28.4,4.8 28.4,4 29.3,4 29.3,4.8
N$10
  Top 0.203: U$5.17 29.55,2.9 R19.1
N$11
  Top 0.203: U$5.10 25.6,5.55 C6.2
N$12  (via drill 0.35)
  Top 0.203: R20.1 24.3,1.15 v24.3,1.9 | v26.8,3.8 U$5.13
  Route2 0.203: v24.3,1.9 24.9,1.9 v26.8,3.8
N$16  (8 unrouted)
  Top 0.61: U$2.S1T 39.65,9.6 C3.1
  Route15 0.61: U$2.S1T U$2.S2T U$2.S3T U$2.S4B
N$27
  Top 0.254: C14.2 20.6,13.55 U$6.4
NEO  (via drill 0.35)
  Top 0.203: JP2.2 4.28,11.79 LED1.1 4.35,11.05 v3.9,10.6
NEOOUT  (via drill 0.35)
  Top 0.203: JP2.1 2.8,13.2 2.52,13.47 v2.3,13.47 LED1.3
  Bottom 0.203: 3.5,13.5 J1.2 3.5,13.47 v2.3,13.47
NRST  (1 unrouted)
  Top 0.203: 22.25,7.05 R2.1 21.75,6.95 20.15,8.55 19.79,8.55 U$9.40
PEN
  Top 0.203: U$4.4 9.15,11.55 8.4,10.8
SBU1
  Top 0.203: U$1.A8 7.66,4.45 8.1,4 8.7,4 9,4.3 9,4.7 10.5,6.2 U$9.12
SBU2  (via drill 0.35)
  Top 0.203: U$1.B8 3.6,6.2 v3.4,6 | U$9.11 10.23,7.8 9.8,7.8 9.1,7.1 v9.1,6.9
  Route2 0.203: v3.4,6 3.5,6.1 7.2,6.1 8,6.9 v9.1,6.9
SWC  (via drill 0.35)  (1 unrouted)
  Top 0.203: U$9.45 16.5,8.79 v16.5,8.5
SWC/FLASH_CS  (1 unrouted)
  Top 0.203: U$7.1 15.55,13.65 13.4,11.5 13.4,11 13.8,10.6
SWD  (via drill 0.35)  (1 unrouted)
  Top 0.203: U$9.46 15.8,8.8 v15.6,8.8
SWD/FLASH_MISO
  Top 0.203: U$7.2 15.65,13.15 14,11.5 14,11.1 14.3,10.8
UFPDET  (via drill 0.35)
  Top 0.203: U$2.CC1 38.33,4.03 38.8,4.5 38.8,7.03 | 41.2,10.95 R3.2 41.1,10.85 41.1,9.33 38.8,7.03 | v35.8,6.3 36.1,6.3 36.83,7.03 U$2.CC2 38.8,7.03 | U$9.48 15.91,11.1 v15.8,11.1
  Route15 0.203: v35.8,6.3 29.4,12.7 17.4,12.7 v15.8,11.1
URST  (via drill 0.35)
  Top 0.203: R21.1 v28.1,2.5 28.55,2.95 U$5.15
  Bottom 0.203: TP1.P$1 27.7,2.9 v28.1,2.5
V_USB  (via drill 0.35)
  Top 0.203: R5.2 36,13.3 R11.1 34.8,11.7 29.95,11.7 U$3.1 | R7.2 C7.1
  Top 0.508: U$2.VBUS2 36.72,2.88 v36.6,3 36.3,3.3 36.3,3.6 36,3.9 33.4,3.9 33.1,3.6 C15.1 C7.1 | U$2.VBUS1 36.68,7.68 v36.6,7.7
  Top 0.813: 36,11.9 v36.4,11.5 v35.6,11.5 36,11.9 | R11.1 36,11.9
  Route2 0.813: v36.6,7.7 35.6,8.7 v35.6,11.5 v36.4,11.5
  Route15 0.508: v36.6,7.7 v36.6,3
VCCA  (1 unrouted)
  Top 0.254: FB1.2 12.6,11.3 11.7,10.4 11.7,9.87 U$9.6
VCORE
  Top 0.254: U$9.43 18.72,9.6 19.9,9.6 21,8.5 C8.1
VMID  (via drill 0.35)
  Top 0.203: U$3.2 31.45,13.45 v31.5,13.5 | 25,11.62 24.62,11.62 | LED1.2 4.35,13.35 v4.9,12.7 | U$6.3 25.15,13.55 25.6,13.1 25.6,11.62 26,11.62
  Top 0.254: U$6.1 24.62,11.62 | v25.2,10.8 25.2,11.62 | 25.2,11.62 25,11.62 | C1.2 26.48,11.62 26,11.62 25.2,11.62
  Top 0.813: 9.7,12.9 v9.2,12.5 v9.9,12.5 9.7,12.9 | U$4.5 9.6,13 9.7,12.9 | R11.2 32.1,12.9 v31.5,13.5 v31.5,12.4 32,12.9 R11.2
  Route2 0.254: v25.2,10.8 25.2,13.5 25,13.5
  Route2 0.813: 30.4,13.5 v31.5,13.5 v31.5,12.4 30.4,13.5 | 30.4,13.5 25,13.5 10.9,13.5 | 10.9,13.5 10.2,13.5 v9.2,12.5 v9.9,12.5 10.9,13.5
  Bottom 0.203: J1.3 v4.9,12.7
  Bottom 0.406: J1.3 6.34,12.5
  Bottom 0.61: 6.34,12.5 v9.2,12.5 v9.9,12.5
VOUT
  Top 0.254: U$1.A9 6.46,3.94 6.21,4.2 U$1.B4 4.2,4.2 4.1,4.1 3.6,4.1 2.7,5 2.7,6.4 3.1,6.8 3.21,6.7 U$1.B9 6.21,6.7 6.46,6.45 U$1.A4
  Top 0.508: 3.1,6.8 3.1,8.6 5.8,11.3 5.8,13 6.25,13.45 U$4.1

### Text on the board
tPlace: D1 | J1 | J2
bPlace: D | R | C | G | V